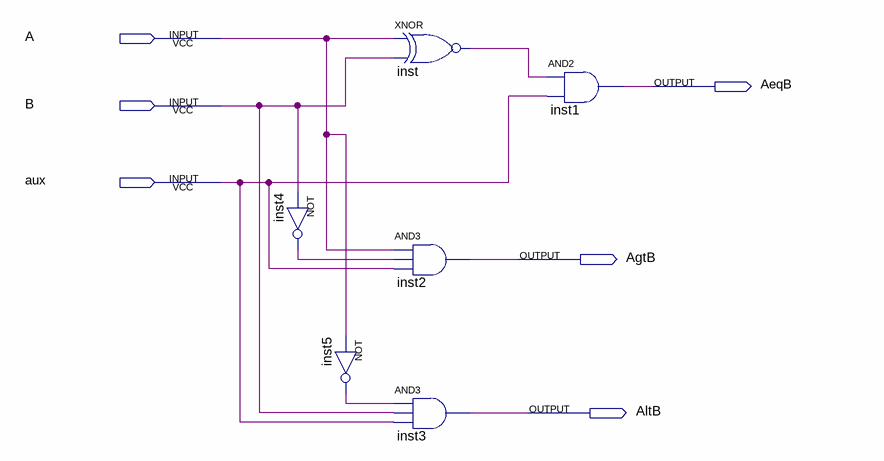
[diagram p0: schematic sheet]
// Quartus schematic comp_magnitude_de_1bit.bdf as structural Verilog: 6 symbols, 6 pins
module comp_magnitude_de_1bit (
  input  A,
  input  B,
  input  aux,
  output AeqB,
  output AgtB,
  output AltB
);

  wire inst4_out, inst5_out, inst_out;

  not inst4 (inst4_out, B);
  not inst5 (inst5_out, A);
  xnor inst (inst_out, A, B);
  and inst2 (AgtB, A, inst4_out, aux);
  and inst3 (AltB, inst5_out, B, aux);
  and inst1 (AeqB, inst_out, aux);
endmodule
